# Altium schematic sheet Power_Sheet.SchDoc
size 420 x 297 mm; SheetNumber: 2; SheetTotal: 11
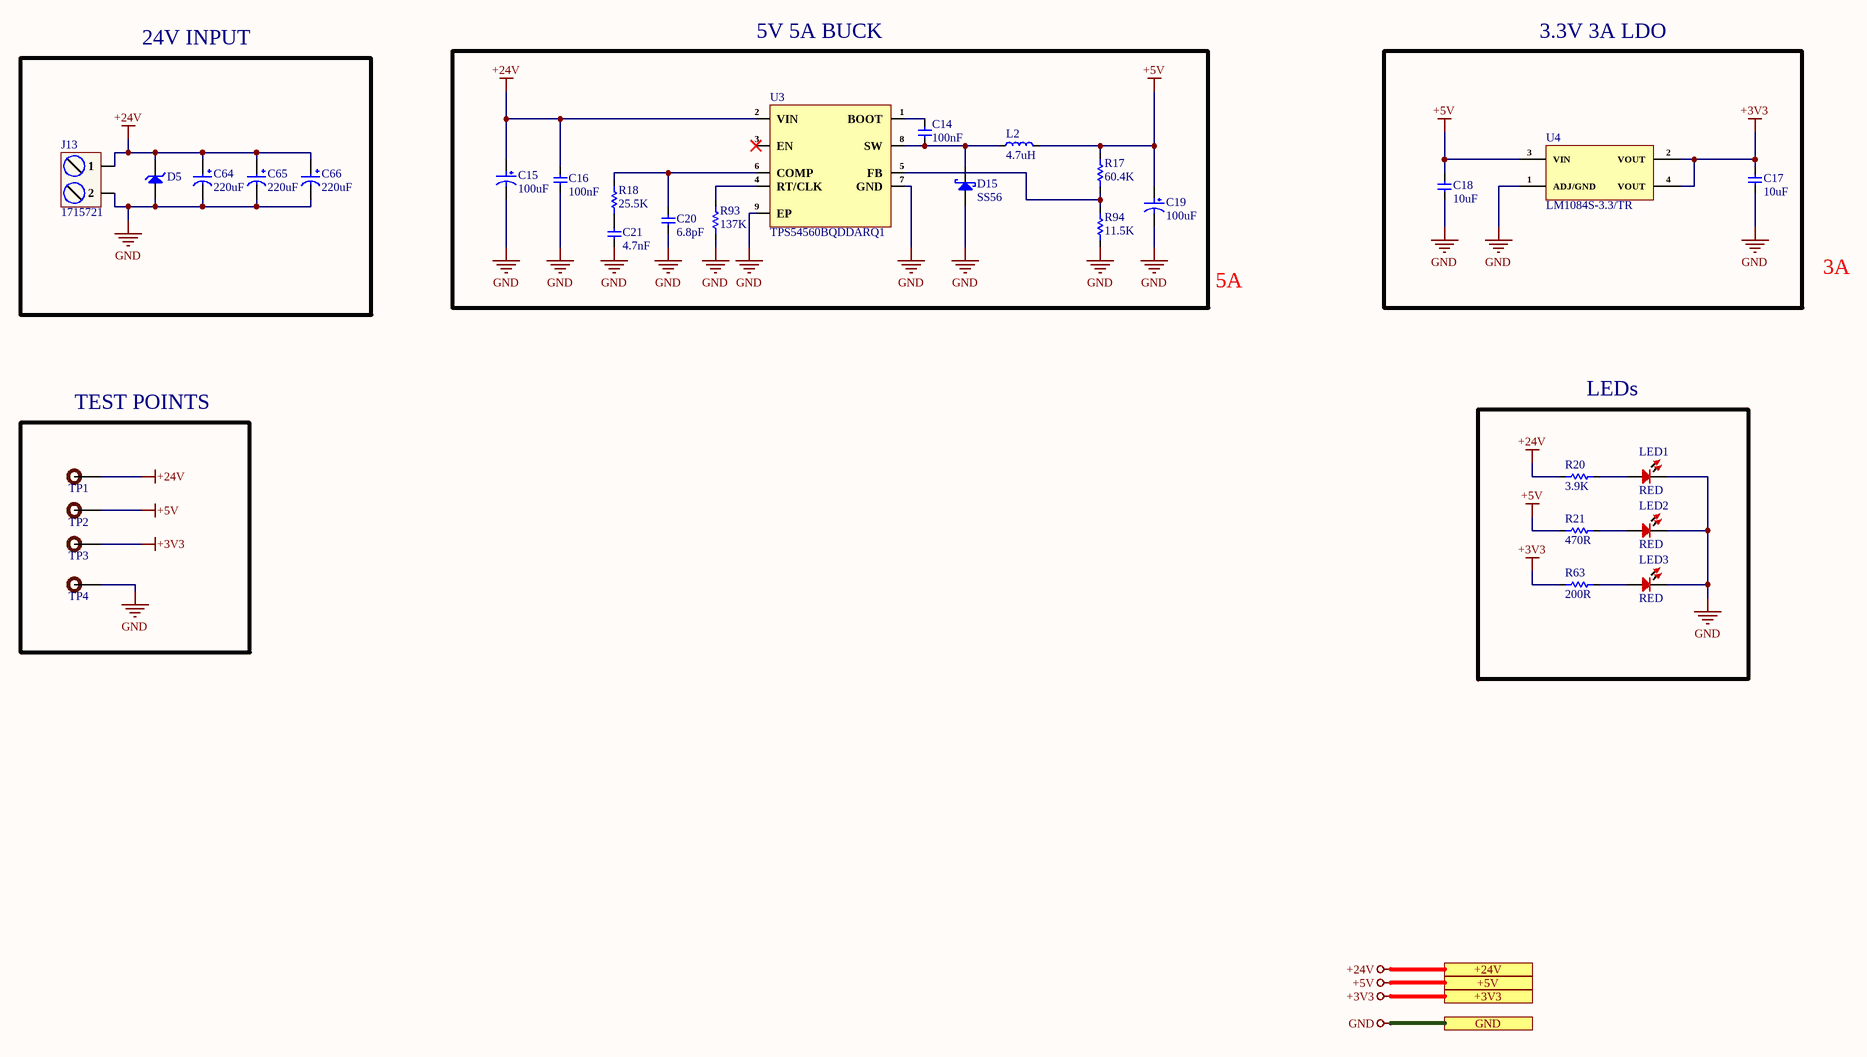
[diagram p0: Power_Sheet.SchDoc]

## Parts
C14  100nF  [cap-0402]
C15  100uF  [RVT1A101M0605]
C16  100nF  [cap-0402]
C17  10uF  [Cap-0603]
C18  10uF  [Cap-0603]
C19  100uF  [RVT1A101M0605]
C20  6.8pF  [Cap-0402]
C21  4.7nF  [Cap-0402]
C64  220uF  [UCD-220uF-10mmDia]
C65  220uF  [UCD-220uF-10mmDia]
C66  220uF  [UCD-220uF-10mmDia]
D5  SMBJ28A-13-F  [SMB_]  (value not drawn)
D15  SS56  [SMA]
J13  1715721  [1715721]
L2  4.7uH  [YSPI1050-4R7M]
LED1  RED  [LED-0603]
LED2  RED  [LED-0603]
LED3  RED  [LED-0603]
R17  60.4K  [Res-0402]
R18  25.5K  [Res-0402]
R20  3.9K  [Res-0402]
R21  470R  [Res-0402]
R63  200R  [Res-0402]
R93  137K  [Res-0402]
R94  11.5K  [Res-0402]
TP1  TEST POINT  [Test-point]  (value not drawn)  (no BOM)
TP2  TEST POINT  [Test-point]  (value not drawn)  (no BOM)
TP3  TEST POINT  [Test-point]  (value not drawn)  (no BOM)
TP4  TEST POINT  [Test-point]  (value not drawn)  (no BOM)
U3  TPS54560BQDDARQ1  [8-SO PowerPad]
U4  LM1084S-3.3/TR  [TO263-3_]

## Blocks framed on the sheet
5V 5A BUCK: C14-C16 C19-C21 D15 L2 R17 R18 R93 R94 U3
3.3V 3A LDO: C17 C18 U4
24V INPUT: C64-C66 D5 J13
TEST POINTS: TP1-TP4
LEDs: LED1-LED3 R20 R21 R63

## Ports
+3V3 (see Top_Sheet[1A], CAN_Sheet[5D], Connector_Sheet[5D], ESP32_Sheet[5D], EtherCAT_Sheet[5D], Ethernet_Sheet[5D], RJ45_Sheet[5D], RS485_RS232_Sheet[5D], STM32_Sheet[5D], TFT_Display_Sheet[5D]), +5V (see Top_Sheet[1A], CAN_Sheet[5D]), +24V (see Top_Sheet[1A], Connector_Sheet[5D]), GND (see Top_Sheet[1A], CAN_Sheet[5D], Connector_Sheet[5D], ESP32_Sheet[5D], EtherCAT_Sheet[5D], Ethernet_Sheet[5D], RJ45_Sheet[5D], RS485_RS232_Sheet[5D], STM32_Sheet[5D], TFT_Display_Sheet[5D])

## Nets
+3V3: C17.2 R63.1 TP3.1 U4.2(VOUT) U4.4(VOUT) ; port +3V3
+5V: C18.2 C19.1 L2.2 R17.2 R21.1 TP2.1 U4.3(VIN) ; port +5V
+24V: C15.1 C16.2 C64.1 C65.1 C66.1 D5.2(K) J13.1 R20.1 TP1.1 U3.2(VIN) ; port +24V
GND: C15.2 C16.1 C17.1 C18.1 C19.2 C20.1 C21.1 C64.2 C65.2 C66.2 D5.1(A) D15.2(A) J13.2 LED1.2 LED2.2 LED3.2 R93.1 R94.1 TP4.1 U3.7(GND) U3.9(EP) U4.1(ADJ/GND) ; port GND
NetC14_1: C14.1 D15.1(K) L2.1 U3.8(SW)
NetC14_2: C14.2 U3.1(BOOT)
NetC20_2: C20.2 R18.2 U3.6(COMP)
NetC21_2: C21.2 R18.1
NetLED1_1: LED1.1 R20.2
NetLED2_1: LED2.1 R21.2
NetLED3_1: LED3.1 R63.2
NetR17_1: R17.1 R94.2 U3.5(FB)
NetR93_2: R93.2 U3.4(RT/CLK)

Not connected (* = marked no-connect by the designer): U3 3(EN)*

## Notes on the sheet
- 5A
- 3A
- File:
- Title:
- Date:
- Page
- Num:
- Total:
- Drawn By: Huzaifa Ali

## Library data of the parts
C14 C16 = C1005X7R1H104KT000F: CAP CER 0.1UF 50V X7R 0402; Manufacturer: TDK; Tolerance: 10%; Voltage: 25V; Item Type: Capacitor; Supplier 1: Avnet; Manufacturer Part Number: C1005X7R1H104KT000F; RoHS: No; Category: Ceramic Capacitors; Dielectric: X7R; Supplier Part Number 1: C1005X7R1H104KT000F; LCSC Part Number: C361198; ComponentLink1Description: LCSC; ComponentLink1URL: https://www.lcsc.com/product-detail/Multilayer-Ceramic-Capacitors-MLCC-SMD-SMT_TDK-C1005X7R1H104KT000F_C361198.html
C15 C19 = RVT1A101M0605: 100uF 10V 55mA@120Hz ±20% SMD,D6.3xL5.4mm Aluminum Electrolytic Capacitors - SMD ROHS; Manufacturer: ROQANG; Manufacturer Part Number: RVT1A101M0605; Package: SMD,D6.3xL5.4mm; LCSC Part Number: C72474; Item Type: Capacitor; ComponentLink1Description: LCSC; ComponentLink1URL: https://www.lcsc.com/product-detail/Aluminum-Electrolytic-Capacitors-SMD_ROQANG-RVT1A101M0605_C72474.html
C17 C18 = C1608X5R1E106M080AC: CAP CER 10UF 25V X5R 0603; Manufacturer: TDK; Dielectric Material: Ceramic; Tolerance: 20%; Item Type: Capacitor; Supplier 1: Digi-Key; Manufacturer Part Number: C1608X5R1E106M080AC; Stock 1: 61681; Pricing 1: 1=0.96, 10=0.704, 100=0.483, 500=0.38238, 1000=0.322 (USD); Mount: Surface Mount; Case/Package: 0603; Weight: 7.1E-05oz; Case Code (Imperial): 0603; Case Code (Metric): 1608; Min Operating Temperature: -55°C; Max Operating Temperature: 85°C; Capacitance: 10uF; Packaging: Tape and Reel; Voltage Rating: 25V; Voltage Rating (DC): 25V; Termination: SMD/SMT; Package Quantity: 1; Dielectric: X5R; Composition: Ceramic; Length: 1.6mm; Height: 0.8mm; Width: 0.8mm; Thickness: 0.039inch; Depth: 0.8mm; Lead Free: Lead Free; REACH SVHC: No SVHC; Supplier Part Number 1: 445-9015-1-ND; LCSC Part Number: C2168289
C20 = CC0402CRNPO9BN6R8: CAP CER 6.8PF 50V C0G/NPO 0402; Manufacturer: Yageo; Dielectric: C0G; Tolerance: 2%; Insulation Resistance: 10GR; Item Type: Capacitor; Supplier: Future Electronics; Supplier Part Number: 3247368; Manufacturer Part Number: CC0402CRNPO9BN6R8; RoHS: Yes; Category: Ceramic Capacitors; Stock: 200000; Pricing: 10000=0.0024, 40000=0.0022, 150000=0.0021, 400000=0.002, 1000000=0.0019 (USD); Mounting Technology: Surface Mount; Case/Package: 0402; Case Code (Imperial): 0402; Case Code (Metric): 1005; Weight: 2.3E-05oz; Min Operating Temperature: -55°C; Max Operating Temperature: 125°C; Value: 6.8pF; Packaging: Tape and Reel; Voltage Rating: 50V; Voltage Rating (DC): 50V; Termination: SMD/SMT; Series: CC; Construction: Flat; Length: 1mm; Width: 0.5mm; Height: 0.5mm; Depth: 0.5mm; Radiation Hardening: No; RoHS Compliant: Yes; ComponentLink1URL: https://datasheet.ciiva.com/11587/upy-gp-np0-16v-to-50v-8-11587182.pdf?src-supplier=Avnet; ComponentLink1Description: https://datasheet.ciiva.com/11587/upy-gp-np0-16v-to-50v-8-11587182.pdf?src-supplier=Avnet; LCSC Part Number: C189470
C21 = CC0402KRX7R9BB472: CAP CER 4700PF 50V X7R 0402; Manufacturer: Yageo; Material: 4241ConductorMaterial; Tolerance: 10%; Temperature Coefficient: 30ppm/°C; Item Type: Capacitor; Supplier 1: Future Electronics; Manufacturer Part Number: CC0402KRX7R9BB472; RoHS: Yes; Category: Ceramic Capacitors; Stock 1: 1780000; Pricing 1: 10000=0.0021, 40000=0.002, 150000=0.0019, 400000=0.0018, 1000000=0.0017 (USD); Mount: Surface Mount; Case/Package: 0402; Number of Pins: 2NUMBER; Case Code (Imperial): 0402; Case Code (Metric): 1005; Min Operating Temperature: -55°C; Max Operating Temperature: 125°C; Capacitance: 4.7nF; Dielectric: X7R; Voltage Rating: 50V; Voltage Rating (DC): 50V; Packaging: Tape and Reel; Package Quantity: 1; Termination: SMD/SMT; Series: CC; Construction: Flat; Length: 1mm; Width: 0.02inch; Height: 0.5mm; Thickness: 0.022inch; Depth: 0.5mm; Radiation Hardening: No; Reach SVHC Compliant: No; RoHS Compliant: Yes; Halogen Free: 5694HalogenFree; Lead Free: 5697LeadFree; ComponentLink1URL: https://datasheet.ciiva.com/7978/1489800-7978108.pdf?src-supplier=Element14; ComponentLink1Description: https://datasheet.ciiva.com/7978/1489800-7978108.pdf?src-supplier=Element14; ComponentLink2URL: https://datasheet.ciiva.com/176/mlccorderingcode-176364.pdf?src-supplier=Digikey; ComponentLink2Description: https://datasheet.ciiva.com/176/mlccorderingcode-176364.pdf?src-supplier=Digikey; ComponentLink3URL: https://datasheet.ciiva.com/176/mlccorderingcode-176363.pdf?src-supplier=Digikey; ComponentLink3Description: https://datasheet.ciiva.com/176/mlccorderingcode-176363.pdf?src-supplier=Digikey; ComponentLink4URL: https://datasheet.ciiva.com/176/mlccorderingcode-176365.pdf?src-supplier=Digikey; ComponentLink4Description: https://datasheet.ciiva.com/176/mlccorderingcode-176365.pdf?src-supplier=Digikey; ComponentLink5URL: https://datasheet.ciiva.com/11586/upy-gphc-x7r-6-3v-to-50v-8-11586491.pdf?src-supplier=Avnet; ComponentLink5Description: https://datasheet.ciiva.com/11586/upy-gphc-x7r-6-3v-to-50v-8-11586491.pdf?src-supplier=Avnet; Supplier Part Number 1: 1989300
C64-C66 = UCD1H221MNL1GS: CAP ALUM 220UF 20% 50V SMD; Manufacturer: Nichicon; Ripple Current: 700mA; Impedance: 160mR; Leakage Current: 3uA; Life (Hours): 5000Hour; Dissipation Factor: 0.1%; Item Type: Capacitor; Supplier 1: Digi-Key; Manufacturer Part Number: UCD1H221MNL1GS; RoHS: Yes; Category: Aluminum Electrolytic Capacitors; Pricing 1: 1=0.85000, 10=0.60200, 50=0.45480, 100=0.39620 (USD); Mount: Surface Mount,PCB; Case/Package: Radial; Min Operating Temperature: -55°C; Max Operating Temperature: 105°C; Capacitance: 220uF; Tolerance: 20%; Voltage Rating: 50V; Packaging: Tape and Reel; Package Quantity: 1; Voltage Rating (DC): 50V; Termination: SMD/SMT; Voltage: 50V; Features: General Purpose; Series: CD; Construction: Cylindrical; Diameter: 10mm; Length: 10mm; Height: 10mm; Height - Seated (Max): 0.394inch; Radiation Hardening: No; Lead Free: Lead Free; RoHS Compliant: Yes; ComponentLink1URL: https://datasheet.ciiva.com/11776/0900766b80ebdadd-11776792.pdf?src-supplier=RSComponents; ComponentLink1Description: https://datasheet.ciiva.com/11776/0900766b80ebdadd-11776792.pdf?src-supplier=RSComponents; ComponentLink2URL: https://datasheet.ciiva.com/5362/e-cd-22158-5362489.pdf?src-supplier=Mouser; ComponentLink2Description: https://datasheet.ciiva.com/5362/e-cd-22158-5362489.pdf?src-supplier=Mouser; ComponentLink3URL: https://datasheet.ciiva.com/11684/e-cd-11684678.pdf?src-supplier=Avnet; ComponentLink3Description: https://datasheet.ciiva.com/11684/e-cd-11684678.pdf?src-supplier=Avnet; ComponentLink4URL: https://datasheet.ciiva.com/15037/e-cd-15037119.pdf?src-supplier=Digi-Key; ComponentLink4Description: https://datasheet.ciiva.com/15037/e-cd-15037119.pdf?src-supplier=Digi-Key; ComponentLink5URL: https://datasheet.ciiva.com/16393/e-cd-16393493.pdf?src-supplier=Future+Electronics; ComponentLink5Description: https://datasheet.ciiva.com/16393/e-cd-16393493.pdf?src-supplier=Future+Electronics; ComponentLink6URL: https://datasheet.ciiva.com/17354/e-cd-17354606.pdf?src-supplier=Avnet+Europe; ComponentLink6Description: https://datasheet.ciiva.com/17354/e-cd-17354606.pdf?src-supplier=Avnet+Europe; Supplier Part Number 1: 493-6390-1-ND; LCSC Part Number: C116211
D5 = SMBJ28A-13-F: TVS DIODE 28VWM 45.4VC SMB; Manufacturer: Diodes; Test Current: 1mA; Number of Elements: 1; Power Dissipation: 600W; Forward Voltage: 5V; Direction: Unidirectional; Reverse Breakdown Voltage: 31.1V; Max Surge Current: 13.2A; Reverse Standoff Voltage: 28V; Clamping Voltage: 45.4V; Power Line Protection: No; Breakdown Voltage: 35.8V; Max Reverse Leakage Current: 5uA; Value: 330pF; Diode Type: ZENER; Supplier: Future Electronics; Supplier Part Number: 8797342; Manufacturer Part Number: SMBJ28A-13-F; RoHS: Yes; Category: TVS Diodes; Stock: 39000; Pricing: 3000=0.0734, 9000=0.0706, 15000=0.0693, 30000=0.0676, 60000=0.065 (USD); Mounting Technology: Surface Mount; Case/Package: SMB; Pins: 2; Min Operating Temperature: -55°C; Max Operating Temperature: 150°C; Packaging: Tape and Reel; Package Quantity: 3000; Max Power Dissipation: 600W; Series: SMBJ; Number of Unidirectional Channels: 1; Min Breakdown Voltage: 31.1V; Peak Pulse Power: 600W; Polarity: Unidirectional; Termination: SMD/SMT; Peak Pulse Current: 13.2A; Max Breakdown Voltage: 35.8V; Leakage Current: 5uA; Working Voltage: 28V; Voltage Rating (DC): 28V; Max Output current: 13.2A; Clamping Voltage-Max: 45.4V; Length: 4.57mm; Width: 3.9mm; Height: 2.62mm; Radiation Hardening: No; RoHS Compliant: Yes; Lead Free: Lead Free; ComponentLink1URL: https://datasheet.ciiva.com/16387/ds19002-16387564.pdf?src-supplier=Future+Electronics; ComponentLink1Description: https://datasheet.ciiva.com/16387/ds19002-16387564.pdf?src-supplier=Future+Electronics; ComponentLink2URL: https://datasheet.ciiva.com/26912/getdatasheetpartid-234000-26912533.pdf?src-supplier=Verical; ComponentLink2Description: https://datasheet.ciiva.com/26912/getdatasheetpartid-234000-26912533.pdf?src-supplier=Verical; Item Type: Diode
D15 = SS56: DIODE SCHOTTKY 60V 5A SMA; Manufacturer: MDD; LCSC Par Number: C65009; Manufacturer Part Number: SS56; Iterm Type: Diode; ComponentLink1Description: LCSC; ComponentLink1URL: https://www.lcsc.com/product-detail/Schottky-Barrier-Diodes-SBD_MDD-Microdiode-Electronics-SS56_C65009.html
J13 = 1715721: TERM BLK 2P SIDE ENT 5.08MM PCB; Manufacturer: Phoenix Contact; Item Type: Terminal Blocks; Supplier: Digikey; Supplier Part Number: 277-1263-ND; Manufacturer Part Number: 1715721; RoHS: Yes; Stock: 13160; Pricing: 1=0.94 (USD); ComponentLink1URL: https://datasheet.ciiva.com/1120/1697161-1120393.pdf?src-supplier=Farnell; ComponentLink1Description: https://datasheet.ciiva.com/1120/1697161-1120393.pdf?src-supplier=Farnell; ComponentLink2URL: https://datasheet.ciiva.com/832/1715721-832095.pdf?src-supplier=Digikey; ComponentLink2Description: https://datasheet.ciiva.com/832/1715721-832095.pdf?src-supplier=Digikey; ComponentLink3URL: https://datasheet.ciiva.com/15169/getdatasheetpartid-212174-15169929.pdf?src-supplier=Verical; ComponentLink3Description: https://datasheet.ciiva.com/15169/getdatasheetpartid-212174-15169929.pdf?src-supplier=Verical; ComponentLink4URL: https://datasheet.ciiva.com/16046/1715721-16046034.pdf?src-supplier=Onlinecomponents.com; ComponentLink4Description: https://datasheet.ciiva.com/16046/1715721-16046034.pdf?src-supplier=Onlinecomponents.com
L2 = YSPI1050-4R7M: 8A 4.7uH ±20% SMD,10x10.1mm Power Inductors ROHS; Manufacturer: YJYCOIN; Manufacturer Part Number: YSPI1050-4R7M; Package: SMD,10.1x10.1mm; LCSC Part Number: C497895; Item Type: Inductor; ComponentLink1Description: LCSC; ComponentLink1URL: https://www.lcsc.com/product-detail/Power-Inductors_YJYCOIN-YSPI1050-4R7M_C497895.html
LED1-LED3 = NCD0603R3: RED LED 0603 Light Emitting Diodes; Manufacturer: Foshan NationStar Optoelectronics; Manufacturer Part Number: NCD0603R3; Package: 0603; Item Type: LED; LCSC Part Number: C3151730; ComponentLink1Description: LCSC; ComponentLink1URL: https://www.lcsc.com/product-detail/Light-Emitting-Diodes-LED_Foshan-NationStar-Optoelectronics-NCD0603R3_C3151730.html
R17 = SCR0402F60K4: 60.4kΩ 50V 62.5mW Thick Film Resistors ±1% 0402 Chip Resistor - Surface Mount ROHS; Manufacturer: VO; Manufacturer Part Number: SCR0402F60K4; Package: 0402; LCSC Part Number: C3016055; Item Type: Resistor; ComponentLink1Description: LCSC; ComponentLink1URL: https://www.lcsc.com/product-detail/Chip-Resistor-Surface-Mount_VO-SCR0402F60K4_C3016055.html
R18 = 0402WGF2552TCE: 62.5mW Thick Film Resistors 50V ±100ppm/℃ ±1% 25.5kΩ 0402 Chip Resistor - Surface Mount ROHS; Manufacturer: Royal Electronic Factory; Value: 25.5kR; Supplier: Mouser; LCSC Part Number: C26970; Manufacturer Part Number: 0402WGF2552TCE; RoHS: Yes; Item Type: Resistor; Pricing: 10000=0.004 (USD); RoHS Compliant: Yes
R20 = RC0402FR-073K9L: RES 3.9K OHM 1% 1/16W 0402; Manufacturer: Yageo; Temperature Coefficient: 100ppm/°C; Power Rating: 62.5mW; Value: 3.9kR; Voltage Rating: 50V; Max Power Dissipation: 63mW; Item Type: Resistor; Supplier: Future Electronics; Supplier Part Number: 9808155; Manufacturer Part Number: RC0402FR-073K9L; RoHS: Yes; Category: Chip SMD Resistors; Stock: 6910000; Pricing: 10000=0.0011, 100000=0.0011, 300000=0.001, 750000=0.001, 2000000=0.0009 (USD); Case/Package: 0402; Case Code (Imperial): 0402; Case Code (Metric): 1005; Min Operating Temperature: -55°C; Max Operating Temperature: 155°C; Tolerance: 1%; Packaging: Tape and Reel; Resistor Type: Thick Film; Series: RC; Termination: SMD/SMT; Number of Terminations: 2; Features: Moisture Resistant; Resistance Tolerance: 1%; Construction: Rectangular; Voltage Rating (AC): 50V; Length: 1mm; Depth: 0.5mm; Lead Free: Lead Free; RoHS Compliant: Yes; Reach SVHC Compliant: Unknown; Military Standard: Not; ComponentLink1URL: https://datasheet.ciiva.com/12666/pyu-rc0402-51-rohs-l-6-r-12666997.pdf?src-supplier=Mouser; ComponentLink1Description: https://datasheet.ciiva.com/12666/pyu-rc0402-51-rohs-l-6-r-12666997.pdf?src-supplier=Mouser; ComponentLink2URL: https://datasheet.ciiva.com/7849/1018594-7849989.pdf?src-supplier=Element14; ComponentLink2Description: https://datasheet.ciiva.com/7849/1018594-7849989.pdf?src-supplier=Element14; ComponentLink3URL: https://datasheet.ciiva.com/7849/1018594-7849990.pdf?src-supplier=Element14; ComponentLink3Description: https://datasheet.ciiva.com/7849/1018594-7849990.pdf?src-supplier=Element14; ComponentLink4URL: https://datasheet.ciiva.com/15189/getdatasheetpartid-469246-15189453.pdf?src-supplier=Verical; ComponentLink4Description: https://datasheet.ciiva.com/15189/getdatasheetpartid-469246-15189453.pdf?src-supplier=Verical; LCSC Part Number: C131467
R21 = RC0402FR-07470RL: RES 470 OHM 1% 1/16W 0402; Manufacturer: Yageo; Item Type: Resistor; Voltage Rating: 50V; Power Rating: 62.5mW; Temperature Coefficient: 100ppm/°C; Max Power Dissipation: 63mW; Supplier: Avnet; Supplier Part Number: RC0402FR-07470RL; Manufacturer Part Number: RC0402FR-07470RL; RoHS: Yes; Stock: 10000; Pricing: 10000=0.00085 (USD); Case/Package: 0402; Case Code (Metric): 1005; Case Code (Imperial): 0402; Min Operating Temperature: -55°C; Max Operating Temperature: 155°C; Packaging: Tape and Reel; Value: 470R; Tolerance: 1%; Number of Terminations: 2; Working Voltage: 50V; Package Quantity: 1; Resistor Type: Thick Film; Termination: SMD/SMT; Features: Moisture Resistant; Series: RC; Resistance Tolerance: 1%; Construction: Rectangular; Voltage Rating (AC): 50V; Length: 1mm; Width: 0.02inch; Height: 0.016inch; Depth: 0.5mm; Lead Free: Lead Free; Reach SVHC Compliant: No; RoHS Compliant: Yes; Military Standard: Not; ComponentLink1URL: https://datasheet.ciiva.com/46412/1018594-46412838.pdf?src-supplier=Element14; ComponentLink1Description: https://datasheet.ciiva.com/46412/1018594-46412838.pdf?src-supplier=Element14; ComponentLink2URL: https://datasheet.ciiva.com/2453/pyu-r-int-thick-7-2453377.pdf?src-supplier=Digikey; ComponentLink2Description: https://datasheet.ciiva.com/2453/pyu-r-int-thick-7-2453377.pdf?src-supplier=Digikey; ComponentLink3URL: https://datasheet.ciiva.com/2453/pyu-r-int-thick-7-2453378.pdf?src-supplier=Digikey; ComponentLink3Description: https://datasheet.ciiva.com/2453/pyu-r-int-thick-7-2453378.pdf?src-supplier=Digikey; ComponentLink4URL: https://datasheet.ciiva.com/2453/pyu-r-int-thick-7-2453376.pdf?src-supplier=Digikey; ComponentLink4Description: https://datasheet.ciiva.com/2453/pyu-r-int-thick-7-2453376.pdf?src-supplier=Digikey; ComponentLink5URL: https://datasheet.ciiva.com/7850/1018594-7850015.pdf?src-supplier=Element14; ComponentLink5Description: https://datasheet.ciiva.com/7850/1018594-7850015.pdf?src-supplier=Element14; ComponentLink6URL: https://datasheet.ciiva.com/7850/1018594-7850014.pdf?src-supplier=Element14; ComponentLink6Description: https://datasheet.ciiva.com/7850/1018594-7850014.pdf?src-supplier=Element14; ComponentLink7URL: https://datasheet.ciiva.com/15189/getdatasheetpartid-330246-15189463.pdf?src-supplier=Verical; ComponentLink7Description: https://datasheet.ciiva.com/15189/getdatasheetpartid-330246-15189463.pdf?src-supplier=Verical; LCSC Part Number: C114877
R63 = RC0402FR-07200RL: RES 200 OHM 1% 1/16W 0402; Manufacturer: Yageo; Temperature Coefficient: 100ppm/°C; Power Rating: 63mW; Voltage Rating (DC): 50V; Supplier 1: Digi-Key; Manufacturer Part Number: RC0402FR-07200RL; RoHS: Yes; Category: Chip SMD Resistors; Stock 1: 19778; Pricing 1: 1=0.10000, 10=0.01600, 100=0.00660, 1000=0.00299, 2500=0.00259, 5000=0.00214 (USD); Case/Package: 0402; Case Code (Metric): 1005; Case Code (Imperial): 0402; Size Code: 0402; Min Operating Temperature: -55°C; Max Operating Temperature: 155°C; Tolerance: 1%; Resistance: 200R; Resistor Type: Thick Film; Packaging: Tape and Reel; Voltage Rating: 50V; Package Quantity: 1; Number of Terminations: 2; Termination: SMD/SMT; Max Power Dissipation: 63mW; Features: Moisture Resistant; Series: RC; Construction: Rectangular; Resistance Tolerance: 1%; Length: 1mm; Width: 0.02inch; Height: 0.016inch; Depth: 0.5mm; REACH SVHC: No SVHC; Lead Free: Lead Free; RoHS Compliant: Yes; Military Standard: Not; ComponentLink1URL: https://datasheet.ciiva.com/2553/pyu-r-int-thick-7-2553232.pdf?src-supplier=Digi-Key; ComponentLink1Description: https://datasheet.ciiva.com/2553/pyu-r-int-thick-7-2553232.pdf?src-supplier=Digi-Key; ComponentLink2URL: https://datasheet.ciiva.com/7983/1018594-7983509.pdf?src-supplier=Element14; ComponentLink2Description: https://datasheet.ciiva.com/7983/1018594-7983509.pdf?src-supplier=Element14; ComponentLink3URL: https://datasheet.ciiva.com/16804/pyu-rc0402-51-rohs-l-6-r-16804406.pdf?src-supplier=Future+Electronics; ComponentLink3Description: https://datasheet.ciiva.com/16804/pyu-rc0402-51-rohs-l-6-r-16804406.pdf?src-supplier=Future+Electronics; ComponentLink4URL: https://datasheet.ciiva.com/15189/getdatasheetpartid-331152-15189383.pdf?src-supplier=Verical; ComponentLink4Description: https://datasheet.ciiva.com/15189/getdatasheetpartid-331152-15189383.pdf?src-supplier=Verical; ComponentLink5URL: https://datasheet.ciiva.com/7849/1018594-7849898.pdf?src-supplier=Element14; ComponentLink5Description: https://datasheet.ciiva.com/7849/1018594-7849898.pdf?src-supplier=Element14; ComponentLink6URL: https://datasheet.ciiva.com/5562/pyu-rc0402-51-rohs-l-6-r-8721-5562539.pdf?src-supplier=Mouser; ComponentLink6Description: https://datasheet.ciiva.com/5562/pyu-rc0402-51-rohs-l-6-r-8721-5562539.pdf?src-supplier=Mouser; ComponentLink7URL: https://datasheet.ciiva.com/7849/1018594-7849899.pdf?src-supplier=Element14; ComponentLink7Description: https://datasheet.ciiva.com/7849/1018594-7849899.pdf?src-supplier=Element14; ComponentLink8URL: https://datasheet.ciiva.com/2553/pyu-r-int-thick-7-2553230.pdf?src-supplier=Digi-Key; ComponentLink8Description: https://datasheet.ciiva.com/2553/pyu-r-int-thick-7-2553230.pdf?src-supplier=Digi-Key; ComponentLink9URL: https://datasheet.ciiva.com/2553/pyu-r-int-thick-7-2553231.pdf?src-supplier=Digi-Key; ComponentLink9Description: https://datasheet.ciiva.com/2553/pyu-r-int-thick-7-2553231.pdf?src-supplier=Digi-Key; Supplier Part Number 1: 311-200LRCT-ND; LCSC Part Number: C114764
R93 = RT0402BRD07137KL: RES SMD 137K OHM 0.1% 1/16W 0402; Manufacturer: Yageo; Item Type: Resistors; Value: 137kR; Max Power Dissipation: 63mW; Temperature Coefficient: 25ppm/°C; Voltage Rating: 50V; Supplier: Digikey; LCSC Part Number: C852519; Manufacturer Part Number: RT0402BRD07137KL; RoHS: Yes; Stock: 18830; Pricing: 1=0.2, 10=0.15, 50=0.1174, 100=0.1051, 500=0.07972, 1000=0.07035, 5000=0.05199 (USD); Case/Package: 0402; Min Operating Temperature: -55°C; Max Operating Temperature: 155°C; Packaging: Tape and Reel; Number of Terminations: 2; Tolerance: 0.1%; Features: Moisture Resistant; Series: RT; Length: 0.039inch; Width: 0.02inch; Height: 0.014inch; ComponentLink1URL: http://www.yageo.com/documents/recent/PYu-RT_1-to-0.01_RoHS_L_8.pdf?src-supplier=Digikey; ComponentLink1Description: http://www.yageo.com/documents/recent/PYu-RT_1-to-0.01_RoHS_L_8.pdf?src-supplier=Digikey
R94 = FRC0402F1152TS: 11.5kΩ 50V 62.5mW Thick Film Resistors ±100ppm/℃ ±1%  0402 Chip Resistor - Surface Mount ROHS; Manufacturer: FOJAN; Manufacturer Part Number: FRC0402F1152TS; Package: 0402; LCSC Part Number: C2933068; Item Type: Resistor; ComponentLink1Description: LCSC; ComponentLink1URL: https://www.lcsc.com/product-detail/Chip-Resistor-Surface-Mount_FOJAN-FRC0402F1152TS_C2933068.html
TP1-TP4 = TEST POINT: Test Point ON; Item Type: TEST POINT
U3 = TPS54560BQDDARQ1: IC REG BCK SPLIT RAIL ADJ 8SOPWR; Manufacturer: Texas Instruments; Max Supply Voltage: 60V; Min Supply Voltage: 4.5V; Nominal Supply Current: 146uA; Supplier: Mouser; Supplier Part Number: 595-TPS54560BQDDARQ1; Manufacturer Part Number: TPS54560BQDDARQ1; RoHS: Yes; Item Type: IC; Stock: 1171; Pricing: 1=6.41, 10=5.44, 50=5.44, 100=4.7, 1000=3.4, 10000=3.29 (USD); Length: 4.89mm; Width: 3.9mm; Height: 1.7mm; Thickness: 1.48mm; ComponentLink1URL: http://www.ti.com/lit/ds/symlink/tps54560b-q1.pdf?src-supplier=Digikey; ComponentLink1Description: http://www.ti.com/lit/ds/symlink/tps54560b-q1.pdf?src-supplier=Digikey; LCSC Part Number: C2072188
U4 = LM1084S-3.3/TR: 72dB@(120Hz) 5A Fixed 3.3V~3.3V Positive 12V TO-263-3 Linear Voltage Regulators (LDO) ROHS; Manufacturer: HGSEMI; Item Type: IC; Manufacturer Part Number: LM1084S-3.3/TR; Package: TO-263-3; LCSC Part Number: C259972; ComponentLink1Description: LCSC; ComponentLink1URL: https://www.lcsc.com/product-detail/Linear-Voltage-Regulators-LDO_HGSEMI-LM1084S-3-3-TR_C259972.html